# Altium project PCB_TPEL_Non_Isolated_DC_DC.PrjPcb
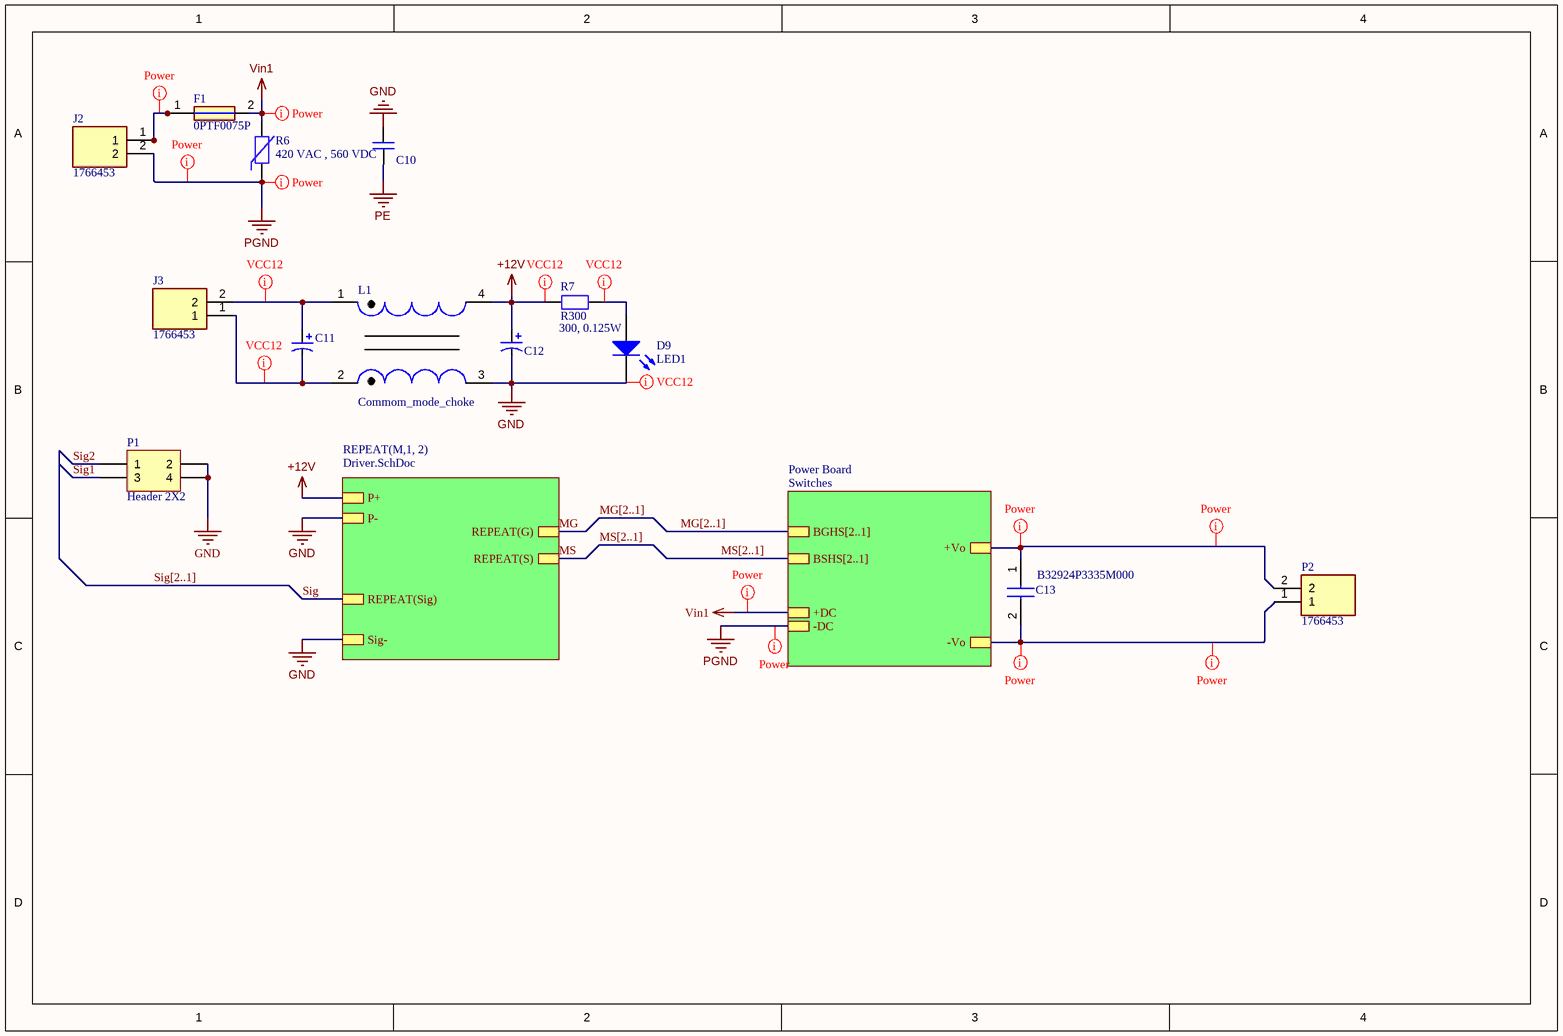
[diagram p0: Main_Clean.SchDoc]
3 sheets, 59 parts. Net scope: hierarchical (ports join the sheet entries above them; power ports are global).
Board file: dc_dc_ver01.PcbDoc
Sheets:
  Main_Clean.SchDoc
    M1 = Driver.SchDoc
    M2 = Driver.SchDoc
    Power Board = Switches.SchDoc

## Sheet Main_Clean.SchDoc
size A4; SheetNumber: 1; SheetTotal: 3

### Parts
C10  Cer_large  [CAPC3227X25N]  (value not drawn)
C11  NACEW102M25V12.5X14  [Cap_pol]  (value not drawn)
C12  NACEW102M25V12.5X14  [Cap_pol]  (value not drawn)
C13  B32924P3335M000  [B32924P_(31.5_x_18)]
D9  LED1  [0805_LED]
F1  0PTF0075P  [0PTF0075P]
J2  1766453  [1766453]
J3  1766453  [1766453]
L1  Commom_mode_choke  [Common_mode]
P1  Header 2X2  [HDR2X2]
P2  1766453  [1766453]
R6  420 VAC , 560 VDC  [AXIAL-0.3]
R7  R300  value 300, 0.125W  [1206_SMD 2]

### Sub-sheets
Power Board = Switches: +DC, -DC, BGHS[2..1], BSHS[2..1], +Vo, -Vo
REPEAT(M,1, 2) = Driver.SchDoc: REPEAT(G), REPEAT(S), Sig-, REPEAT(Sig), P-, P+

### Nets
+12V: C12.1 L1.4 R7.1 ; sheet REPEAT(M,1, 2)/P+
GND: C10.1 C12.2 D9.2(K) L1.3 P1.2 P1.4 ; sheet REPEAT(M,1, 2)/Sig-, sheet REPEAT(M,1, 2)/P-
MS1: C13.2 J2.2 P2.1 R6.1 ; sheet Power Board/-DC, sheet Power Board/-Vo  [also labelled MS2, PGND]
PE: C10.2
Vin1: F1.2 R6.2 ; sheet Power Board/+DC
MG: sheet REPEAT(M,1, 2)/REPEAT(G)
MS: sheet REPEAT(M,1, 2)/REPEAT(S)
Sig: sheet REPEAT(M,1, 2)/REPEAT(Sig)
Sig1: P1.3
Sig2: P1.1
NetC11_1: C11.1 J3.2 L1.1
NetC11_2: C11.2 J3.1 L1.2
NetC13_1: C13.1 P2.2 ; sheet Power Board/+Vo
NetD9_1: D9.1(A) R7.2
NetF1_1: F1.1 J2.1

### Buses and harness runs
bus MG[2..1]
bus MG[2..1] = sheet Power Board/BGHS[2..1]
bus MS[2..1]
bus MS[2..1] = sheet Power Board/BSHS[2..1]
bus Sig[2..1]

### Layout directives
net class Power: MS1, NetC13_1, NetF1_1, Vin1
net class +12: +12V, GND, NetC11_1, NetC11_2, NetD9_1

### Notes on the sheet
- DWG. NO.
- REV.
- SHT.
- REVISION
- DESCRIPTION
- DATE
- APPROVED
- THIS DOCUMENT AND THE DATA DISCLOSED HEREIN OR HEREWITH IS THE PROPERTY OF ALTIUM LIMITED AND MAY BE FREELY DISTRIBUTED IN WHOLE. NO RIGHTS ARE RESERVED OR EXPRESS OR IMPLIED WARANTEE GIVEN.
- ENG:
- DSN:
- APPROVALS
- PROJECT
- DOCUMENT REVISION:
- DESIGN ITEM:
- CHK:
- BOM:
- REFERENCE DOCUMENTS
- PROJECT REVISION:
- TITLE
- FAB DWG:
- PCB DWG:
- ASSY DWG:
- SCALE:
- SIZE
- C
- CAGE CODE
- FILE NAME
- DWG NO.
- SHEET
- OF
- REV

### Library data of the parts
C10 = Cer_large: Order code: 1759466; Value: 22mkF; Type: 16V; Supplier: Farnel; Price: 0.407; Package: 1210
C11 C12 = NACEW102M25V12.5X14: Value: 1 mF; Type: 25V; Order code: 16731346; Supplier: Elfa; Price: 3,28
C13 = B32924P3335M000: Capacitor; Manufacturer_Name: TDK; Datasheet Link: https://product.tdk.com/system/files/dam/doc/product/capacitor/film/emi/data_sheet/x2_b32922_924_p_q.pdf; Height: 33mm; Manufacturer_Part_Number: B32924P3335M000; Mouser Part Number: 871-B32924P3335M000; Mouser Price/Stock: https://www.mouser.co.uk/ProductDetail/EPCOS-TDK/B32924P3335M000?qs=KUoIvG%2F9IlY7%252B78GbxRzbA%3D%3D
D9 = LED1: Typical RED GaAs LED; pin to pad: 1>A 2>K; Published: 8-Jun-2000; LatestRevisionDate: 08-Jul-2005; LatestRevisionNote: Mech Layer 1 removed.; PackageReference: LED-1; Publisher: Altium Limited; PackageDescription: LED; 2 Leads
F1 = 0PTF0075P: Fuse; Manufacturer_Name: LITTELFUSE; Datasheet Link: https://media.digikey.com/pdf/Data%20Sheets/Littelfuse%20PDFs/0PTF0075P_Dwg.pdf; Height: 11.5mm; Manufacturer_Part_Number: 0PTF0075P; Mouser Part Number: 576-0PTF0075P; Mouser Price/Stock: https://www.mouser.co.uk/ProductDetail/Littelfuse/0PTF0075P?qs=gu7KAQ731UQYbEqVl9aylw%3D%3D; Arrow Part Number: 0PTF0075P; Arrow Price/Stock: https://www.arrow.com/en/products/0ptf0075p/littelfuse?region=europe
J2 J3 P2 = 1766453: Connector; Manufacturer_Name: Phoenix Contact; Datasheet Link: http://www.phoenixcontact.com/de/produkte/1766453/pdf; Height: 12mm; Manufacturer_Part_Number: 1766453; Mouser Part Number: 651-1766453; Mouser Price/Stock: https://www.mouser.co.uk/ProductDetail/Phoenix-Contact/1766453?qs=s6DiDDoRpTbteEwY3ZEIDg%3D%3D
L1 = Commom_mode_choke: Manufacturer: Wьrth Elektronik; Type: Common mode choke; Value: 20 mH 0.5 A; Order code: 15857854; Supplier: Elfa; Package: Trough_hole; Price: 4,54
P1 = Header 2X2: Header, 2-Pin, Dual row; LatestRevisionDate: 17-Jul-2002; LatestRevisionNote: Re-released for DXP Platform.; Publisher: Altium Limited
R6 = Var_V420LA10P: 420 VAC , 560 VDC, Varistor; Manufacturer: EPCOS; PartNumber: B72207S0461K101; Order code: 871-B72207S461K101; Type: Varistors; Supplier: Mouser; Price: 0,432; Package: 48X8X6 mm; Supplier 1: Mouser; Supplier Part Number 1: 871-B72207S461K101; Value: 420 VAC , 560 VDC
R7 = R300: Type: 16V, 1%; Package: smd 2010; Price: *; Supplier: *; Order code: *; Manufacturer: *

## Sheet Driver.SchDoc
size A; SheetNumber: 3; SheetTotal: 3
Used 2 times, as channels M1, M2. Parts and nets are listed once, with the designators drawn on the sheet.
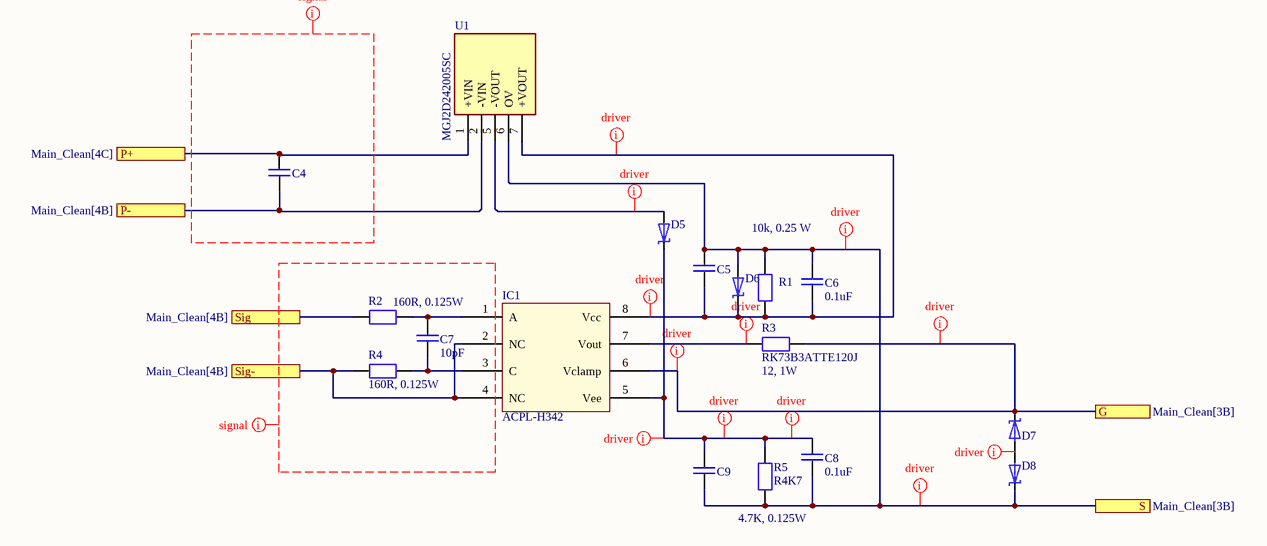
[diagram p1: Driver.SchDoc]

### Parts
C4  Cer_large  [CAPC3227X25N]  (value not drawn)
C5  Cer_large  [CAPC3227X25N]  (value not drawn)
C6  value 0.1uF  [C_0805]  (hidden comment: C0805C104K5RAC)
C7  value 10pF  [C_0805]  (hidden comment: C0805C100J1GAC)
C8  value 0.1uF  [C_0805]  (hidden comment: C0805C104K5RAC)
C9  Cer_large  [CAPC3227X25N]  (value not drawn)
D5  Zener_1.8V  [SOD123]  (value not drawn)
D6  DZ2J220M0L  [SOD323F]  (value not drawn)
D7  MMSZ4678T1G  [CAPM3216X18N]  (value not drawn)
D8  MMSZ4678T1G  [CAPM3216X18N]  (value not drawn)
IC1  ACPL-H342  [SOIC127P970X330-8N]
R1  value 10k, 0.25 W  [SMD_1206]  (hidden comment: RK73H2BTTD1002F)
R2  value 160R, 0.125W  [SMD_0805]  (hidden comment: RK73H2ATTD1600F)
R3  RK73B3ATTE120J  value 12, 1W  [SMD_2512]
R4  value 160R, 0.125W  [SMD_0805]  (hidden comment: RK73H2ATTD1600F)
R5  R4K7  value 4.7K, 0.125W  [smd_0603]
U1  MGJ2D242005SC  [MURATA-MGJ2]

### Ports
G (see Main_Clean[3B]), P+ (see Main_Clean[4C]), P- (see Main_Clean[4B]), S (see Main_Clean[3B]), Sig (see Main_Clean[4B]), Sig- (see Main_Clean[4B])

### Nets
G: D7.1 IC1.6(Vclamp) R3.2 ; port G
P+: C4.1 U1.1(+VIN) ; port P+
P-: C4.2 U1.2(-VIN) ; port P-
S: C5.1 C6.1 C8.2 C9.2 D6.1 D8.1 R1.2 R5.1 U1.6(OV) ; port S
Sig: R2.1 ; port Sig
Sig-: IC1.2(NC) IC1.4(NC) R4.1 ; port Sig-
NetC5_2: C5.2 C6.2 D6.2 IC1.8(Vcc) R1.1 U1.7(+VOUT)
NetC7_1: C7.1 IC1.1(A) R2.2
NetC7_2: C7.2 IC1.3(C) R4.2
NetC8_1: C8.1 C9.1 D5.2 IC1.5(Vee) R5.2
NetD5_1: D5.1 U1.5(-VOUT)
NetD7_2: D7.2 D8.2
NetIC1_7: IC1.7(Vout) R3.1

### Channels
M1: designators end in _M1; ports G=G1 P+=+12V P-=GND S=MS1 Sig-=GND Sig=Sig1
M2: designators end in _M2; ports G=G2 P+=+12V P-=GND S=MS1 Sig-=GND Sig=Sig2

### Layout directives
net class Driver: G1, MS1, NetC5_M1_2, NetC8_M1_1, NetD5_M1_1, NetD7_M1_2, NetIC1_M1_7
net class Signal: (no net found under the mark)

### Library data of the parts
C4 C5 C9 = Cer_large: as C10 on sheet Main_Clean; Supplier: Farnel; Price: 0.407; Package: 1210
C6 C8 = C0805C104K5RAC: 0.1u, 50V; Manufacturer: Kemet; Order code: 6576631; Supplier: Elfa; Price: 0,06; Type: C0805C104K5RAC; Package: smd 0805
C7 = C0805C100J1GAC: 10p, 100V; Manufacturer: Kemet; Order code: 6576805; Supplier: Elfa; Price: 0,266; Type: C0805C100J1GAC; Package: smd 0805
D5 = Zener_1.8V: Zener diode; Type: 0.5W; Value: 1.8V; Order code: 1459115; Supplier: Farnell; Price: 0.172; Package: SOD-123
D6 = DZ2J220M0L: Type: Zener diode; Value: 22V, 200mW; Order code: 2285315; Package: SOD323F; Supplier: Farnel; Price: 0.041
D7 D8 = Zener_MMSZ5233BT1G: 6V, 500mW, Zener Diodes; Manufacturer: ON Semiconductor; Order code: 863-MMSZ5233BT1G; Supplier: Mouser; Price: 0,18; Package: SOD-123-2; Type: Zener Diodes; PartNumber: MMSZ5233BT1G; Value: 6V, 500mW
IC1 = ACPL-H342: Manufacturer: Avago; Order code: 1833408; Value: 2,5 A, 12-30V; Package: SSO-8; Price: 2; Publisher: *; Supplier: Farnell; Type: ACPL-H342
R1 = RK73H2BTTD1002F: 10k, 0.25 W; Manufacturer: KOA; Order code: 6019731; Price: 0,111; Supplier: Elfa; datasheet: https://www1.elfa.se/data1/wwwroot/assets/datasheets/06016752.pdf; Type: RK73H2BTTD1002F; Package: smd 1206
R2 R4 = RK73H2ATTD1600F: 160R, 0.125W; Manufacturer: KOA; Order code: 60-173-05; Type: 1%, 150V; Price: 0.097; Package: smd 0805; Supplier: Elfa
R3 = RK73B3ATTE120J: Manufacturer: KOA; Order code: 60-205-98; Type: 200V, 5%; Supplier: Elfa; Price: 0,144; Package: smd 2512
R5 = R4K7: Order code: 9332154; Type: 16V, 1%; Package: smd 0603; Manufacturer: *; Supplier: Farnel; Price: 0.01
U1 = MGJ2D242005SC: Undefined or Miscellaneous; Manufacturer_Name: Murata Electronics; Datasheet Link: http://power.murata.com/data/power/ncl/kdc_mgj2.pdf; Manufacturer_Part_Number: MGJ2D242005SC; Mouser Part Number: 580-MGJ2D242005SC; Mouser Price/Stock: https://www.mouser.co.uk/ProductDetail/Murata-Power-Solutions/MGJ2D242005SC?qs=xLDY6iXSiQZFsrjCzeaXXw%3D%3D; Arrow Part Number: MGJ2D242005SC; Arrow Price/Stock: https://www.arrow.com/en/products/mgj2d242005sc/murata-power-solutions?region=nac

## Sheet Switches.SchDoc
size A; SheetNumber: 2; SheetTotal: 3; SPICEModelCacheMQZXYCRS: <root> / <DocumentId>MQZXYCRS</DocumentId> / <CacheFrame Number="0"> / <Model Name="diode" Kind="MDL"> / <Text>*Default Diode / *Diode Pinout: A,K / .MODEL DIODE D()</Text> / </Model> / </CacheFrame> / </root>
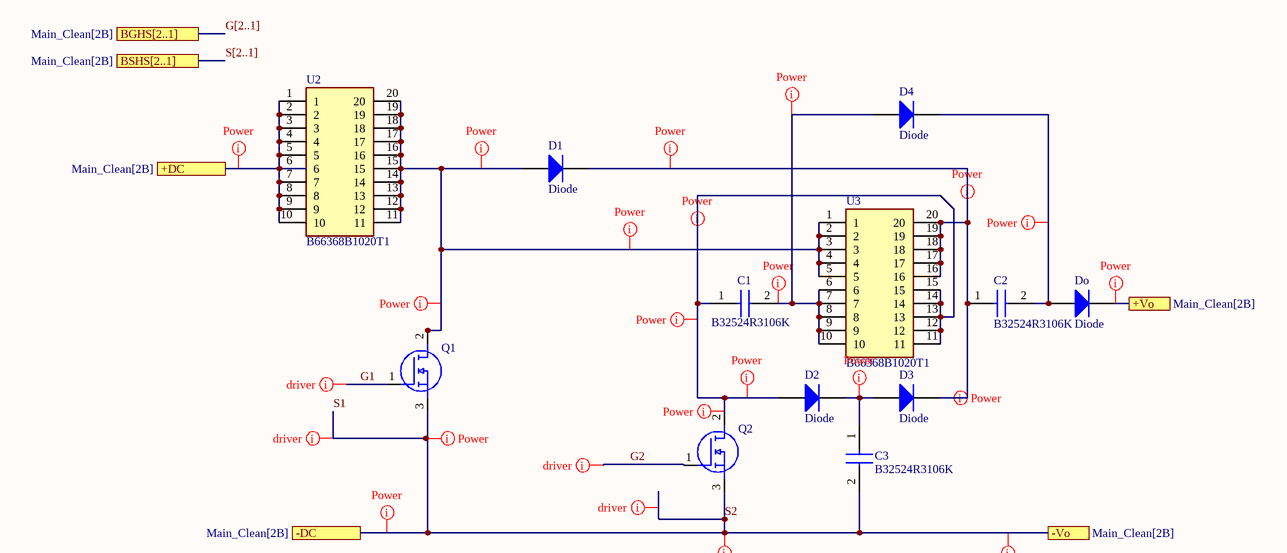
[diagram p2: Switches.SchDoc]

### Parts
C1  B32524R3106K  [B32524R3106K]
C2  B32524R3106K  [B32524R3106K]
C3  B32524R3106K  [B32524R3106K]
D1  Diode  [Dpak]
D2  Diode  [Dpak]
D3  Diode  [Dpak]
D4  Diode  [Dpak]
Do  Diode  [Dpak]
Q1  IPB048N15N5LFATMA1  [D2PAK]  (value not drawn)
Q2  IPB048N15N5LFATMA1  [D2PAK]  (value not drawn)
U2  B66368B1020T1  [B66368B1020T1]
U3  B66368B1020T1  [B66368B1020T1]

### Ports
+DC (see Main_Clean[2B]), +Vo (see Main_Clean[2B]), -DC (see Main_Clean[2B]), -Vo (see Main_Clean[2B]), BGHS[2..1] (see Main_Clean[2B]), BSHS[2..1] (see Main_Clean[2B])

### Nets
S1: C3.2 Q1.3(S) Q2.3(S) ; port -DC, port -Vo  [also labelled S2]  [project net MS1]
Vin1: U2.1 U2.2 U2.3 U2.4 U2.5 U2.6 U2.7 U2.8 U2.9 U2.10 ; port +DC
G1: Q1.1(G)
G2: Q2.1(G)
NetC1_1: C1.1 D2.1(A) Q2.2(D) U3.11 U3.12 U3.13 U3.14 U3.15
NetC1_2: C1.2 D4.1(A) U3.6 U3.7 U3.8 U3.9 U3.10
NetC2_1: C2.1 D1.2(K) D3.2(K) U3.16 U3.17 U3.18 U3.19 U3.20
NetC2_2: C2.2 D4.2(K) Do.1(A)
NetC3_1: C3.1 D2.2(K) D3.1(A)
NetC13_1: Do.2(K) ; port +Vo
NetD1_1: D1.1(A) Q1.2(D) U2.11 U2.12 U2.13 U2.14 U2.15 U2.16 U2.17 U2.18 U2.19 U2.20 U3.1 U3.2 U3.3 U3.4 U3.5

### Buses and harness runs
bus G[2..1] = port BGHS[2..1]
bus S[2..1] = port BSHS[2..1]

### Layout directives
net class Power: G1, G2, MS1, NetC1_1, NetC1_2, NetC2_1, NetC2_2, NetC3_1, NetC13_1, NetD1_1, Vin1

### Library data of the parts
C1-C3 = B32524R3106K: Capacitor; Manufacturer_Name: TDK; Datasheet Link: https://componentsearchengine.com/Datasheets/1/B32524R3106K.pdf; Height: 21.5mm; Manufacturer_Part_Number: B32524R3106K; Mouser Part Number: 871-B32524R3106K; Mouser Price/Stock: https://www.mouser.co.uk/ProductDetail/EPCOS-TDK/B32524R3106K?qs=xEJ61ozf1a2Uwb6OZwaixw%3D%3D; Arrow Part Number: B32524R3106K; Arrow Price/Stock: https://www.arrow.com/en/products/b32524r3106k/epcos-tdk?region=nac
D1-D4 Do = Diode: Default Diode; Published: 8-Jun-2000; LatestRevisionDate: 17-Jul-2002; LatestRevisionNote: Re-released for DXP Platform.; PackageVersion: Sep-1996; PackageReference: SMC; Publisher: Altium Limited; PackageDescription: DO-214-AB/SMC; 2 C-Bend Leads; Body 7.9 x 5.9 mm, inc. leads (LxW); Code_JEDEC: DO-214-AB
Q1 Q2 = IPB048N15N5LFATMA1: Trans MOSFET N-CH 150V 120A 3-Pin(2+Tab) D2PAK T/R; Manufacturer_Name: Infineon; Geometry.Height: 4.82mm; Mouser Part Number: 726-IPB048N15N5LF; Mouser Price/Stock: https://www.mouser.co.uk/ProductDetail/Infineon-Technologies/IPB048N15N5LFATMA1?qs=HXFqYaX1Q2ypITzfwKA8Fg%3D%3D; Manufacturer_Part_Number: IPB048N15N5LFATMA1; Datasheet Link: https://componentsearchengine.com/Datasheets/1/IPB048N15N5LFATMA1.pdf
U2 U3 = B66368B1020T1: Undefined or Miscellaneous; Manufacturer_Name: TDK; Datasheet Link: https://www.mouser.com/datasheet/2/400/etd_49_25_16-1220447.pdf; Height: 40.9mm; Manufacturer_Part_Number: B66368B1020T1; Mouser Part Number: 871-B66368B1020T1; Mouser Price/Stock: https://www.mouser.co.uk/ProductDetail/EPCOS-TDK/B66368B1020T1?qs=fWY6Jreybtns4G%252BQgkB59A%3D%3D; Arrow Part Number: B66368B1020T1; Arrow Price/Stock: https://www.arrow.com/en/products/b66368b1020t1/epcos-tdk?region=nac

## Nets that join several sheets
+12V: Main_Clean (C12.1 L1.4 R7.1), M1 (C4_M1.1 U1_M1.1), M2 (C4_M2.1 U1_M2.1)
GND: Main_Clean (6 pins), M1 (5 pins), M2 (5 pins)
MS1: Main_Clean (C13.2 J2.2 P2.1 R6.1), M1 (9 pins), M2 (9 pins), Switches (C3.2 Q1.3 Q2.3)
Vin1: Main_Clean (F1.2 R6.2), Switches (10 pins)
G1: M1 (D7_M1.1 IC1_M1.6 R3_M1.2), Switches (Q1.1)
G2: M2 (D7_M2.1 IC1_M2.6 R3_M2.2), Switches (Q2.1)
NetC13_1: Main_Clean (C13.1 P2.2), Switches (Do.2)
Sig1: Main_Clean (P1.3), M1 (R2_M1.1)
Sig2: Main_Clean (P1.1), M2 (R2_M2.1)